# EAGLE design distance_sensor (EAGLE 5.06)
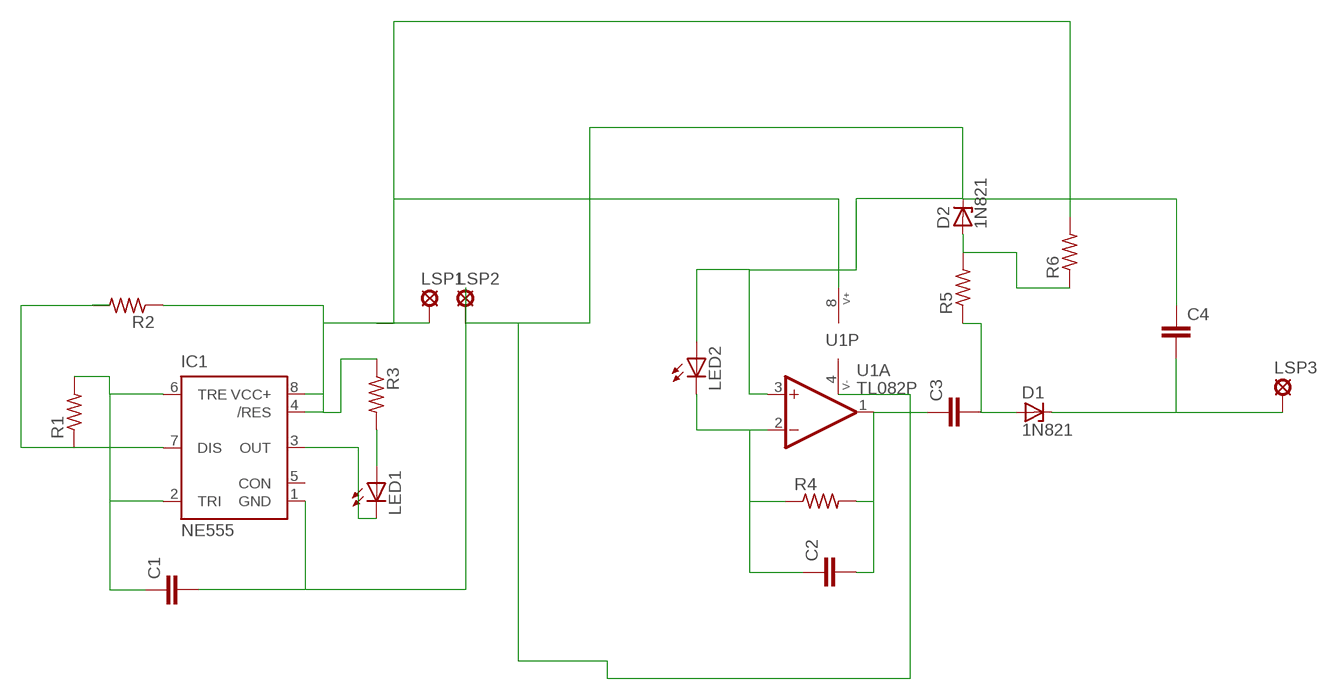
[diagram p0: schematic, sheet 1]

## Parts
C1  C5/4.5  [C5B4.5]
C2  C5/4.5  [C5B4.5]
C3  C5/4.5  [C5B4.5]
C4  C5/4.5  [C5B4.5]
D1  1N821  [DO35Z10]
D2  1N821  [DO35Z10]
IC1  NE555  [DIL-08]
LED1  LEDSFH480  [SFH480]
LED2  LEDSFH480  [SFH480]
LSP1  LSP10  [LSP10]
LSP2  LSP10  [LSP10]
LSP3  LSP10  [LSP10]
R1  R-US_0207/10  [0207/10]
R2  R-US_0207/10  [0207/10]
R3  R-US_0207/10  [0207/10]
R4  R-US_0207/10  [0207/10]
R5  R-US_0207/10  [0207/10]
R6  R-US_0207/10  [0207/10]
U1  TL082P  [DIL08]

## Nets
N$1: C3.2 D1.A R5.1
N$2: C1.1 IC1.2(TRI) IC1.6(TRE) R1.2
N$3: C1.2 C4.1 D2.C IC1.1(GND) LED2.A LSP2.MP U1.3(A:+IN) U1.4(P:V-)
N$4: IC1.7(DIS) R1.1 R2.2
N$5: IC1.4(/RES) IC1.8(VCC+) LSP1.MP R2.1 R3.1 R6.2 U1.8(P:V+)
N$6: LED1.A R3.2
N$7: IC1.3(OUT) LED1.K(C)
N$10: C2.1 LED2.K(C) R4.1 U1.2(A:-IN)
N$11: C2.2 C3.1 R4.2 U1.1(A:OUT)
N$13: C4.2 D1.C LSP3.MP
N$14: D2.A R5.2 R6.1
Unconnected: IC1.5(CON) U1.5(B:+IN) U1.6(B:-IN) U1.7(B:OUT)

## Library data of the parts
C1-C4 = capacitor-wima:C: CAPACITOR naming: grid - package width
D1 D2 = diode:1N821: Reference DIODE temperature compensated, 6,2 V
IC1 = st-microelectronics:NE555: General purpose bipolar Timer
LED1 LED2 = led:LED: LED OSRAM: - CHIPLED LG R971, LG N971, LY N971, LG Q971, LY Q971, LO R971, LY R971 LH N974, LH R974 LS Q976, LO Q976, LY Q976 LO Q996 - Hyper CHIPLED LW Q18S LB Q993, LB Q99A, LB R99A - SideLED LS A670, LO A670, LY A670, LG A670, LP A670 LB A673, LV A673, LT A673, LW A673 LH A674 LY A675 LS A676, LA A676, LO A676, LY A676, LW A676 LS A679, LY A679, LG A679 - Hyper Micro SIDELED® LS Y876, LA Y876, LO Y876, LY Y876 LT Y87S - SmartLED LW L88C, LW L88S LB L89C, LB L89S, LG L890 LS L89K, LO L89K, LY L89K LS L896, LA L896, LO L896, LY L896 - TOPLED LS T670, LO T670, LY T670, LG T670, LP T670 LSG T670, LSP T670, LSY T670, LOP T670, LYG T670 LG T671, LOG T671, LSG T671 LB T673, LV T673, LT T673, LW T673 LH T674 LS T676, LA T676, LO T676, LY T676, LB T676, LH T676, LSB T676, LW T676 LB T67C, LV T67C, LT T67C, LS T67K, LO T67K, LY T67K, LW E67C LS E67B, LA E67B, LO E67B, LY E67B, LB E67C, LV E67C, LT E67C LW T67C LS T679, LY T679, LG T679 LS T770, LO T770, LY T770, LG T770, LP T770 LB T773, LV T773, LT T773, LW T773 LH T774 LS E675, LA E675, LY E675, LS T675 LS T776, LA T776, LO T776, LY T776, LB T776 LHGB T686 LT T68C, LB T68C - Hyper Mini TOPLED® LB M676 - Mini TOPLED Santana® LG M470 LS M47K, LO M47K, LY M47K Source: http://www.osram.convergy.de LUXEON: - LUMILED® LXK2-PW12-R00, LXK2-PW12-S00, LXK2-PW14-U00, LXK2-PW14-V00 LXK2-PM12-R00, LXK2-PM12-S00, LXK2-PM14-U00 LXK2-PE12-Q00, LXK2-PE12-R00, LXK2-PE12-S00, LXK2-PE14-T00, LXK2-PE14-U00 LXK2-PB12-K00, LXK2-PB12-L00, LXK2-PB12-M00, LXK2-PB14-N00, LXK2-PB14-P00, LXK2-PB14-Q00 LXK2-PR12-L00, LXK2-PR12-M00, LXK2-PR14-Q00, LXK2-PR14-R00 LXK2-PD12-Q00, LXK2-PD12-R00, LXK2-PD12-S00 LXK2-PH12-R00, LXK2-PH12-S00 LXK2-PL12-P00, LXK2-PL12-Q00, LXK2-PL12-R00 Source: www.luxeon.com KINGBRIGHT: KA-3528ASYC Source: www.kingbright.com
LSP1-LSP3 = solpad:LSP10: SOLDER PAD drill 1.0 mm, distributor Buerklin, 12H555
R1-R6 = rcl:R-US_: RESISTOR, American symbol
U1 = op-amp:TL082: JFET OP-AMP - Dual

## Board
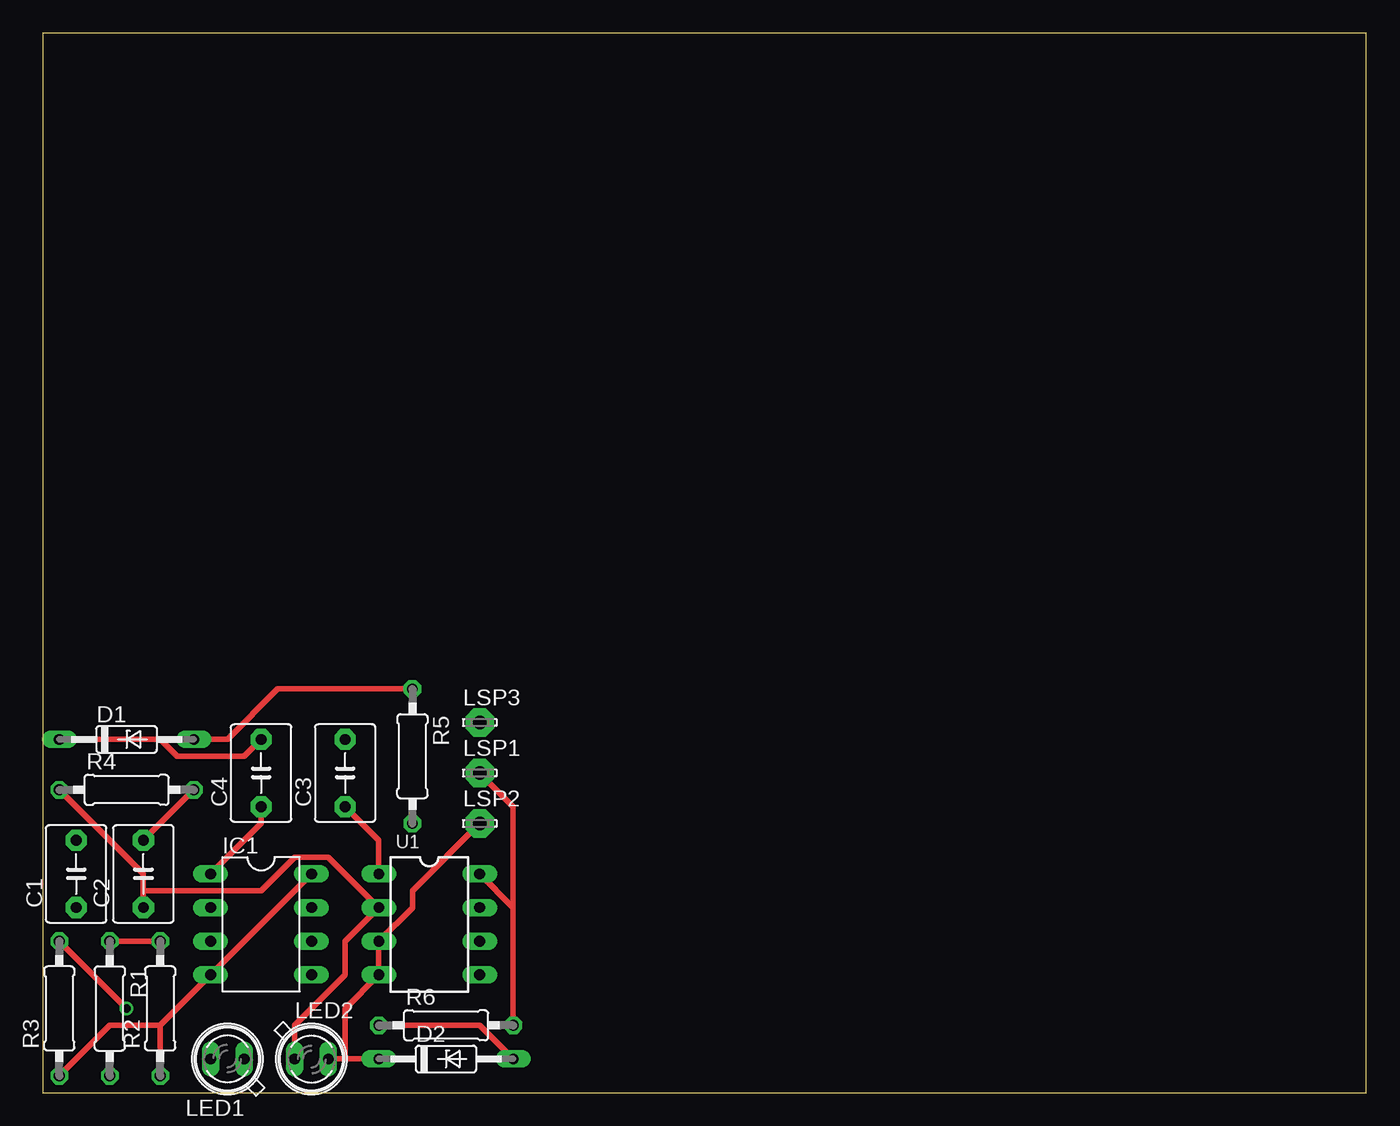
[diagram p1: board, top side]
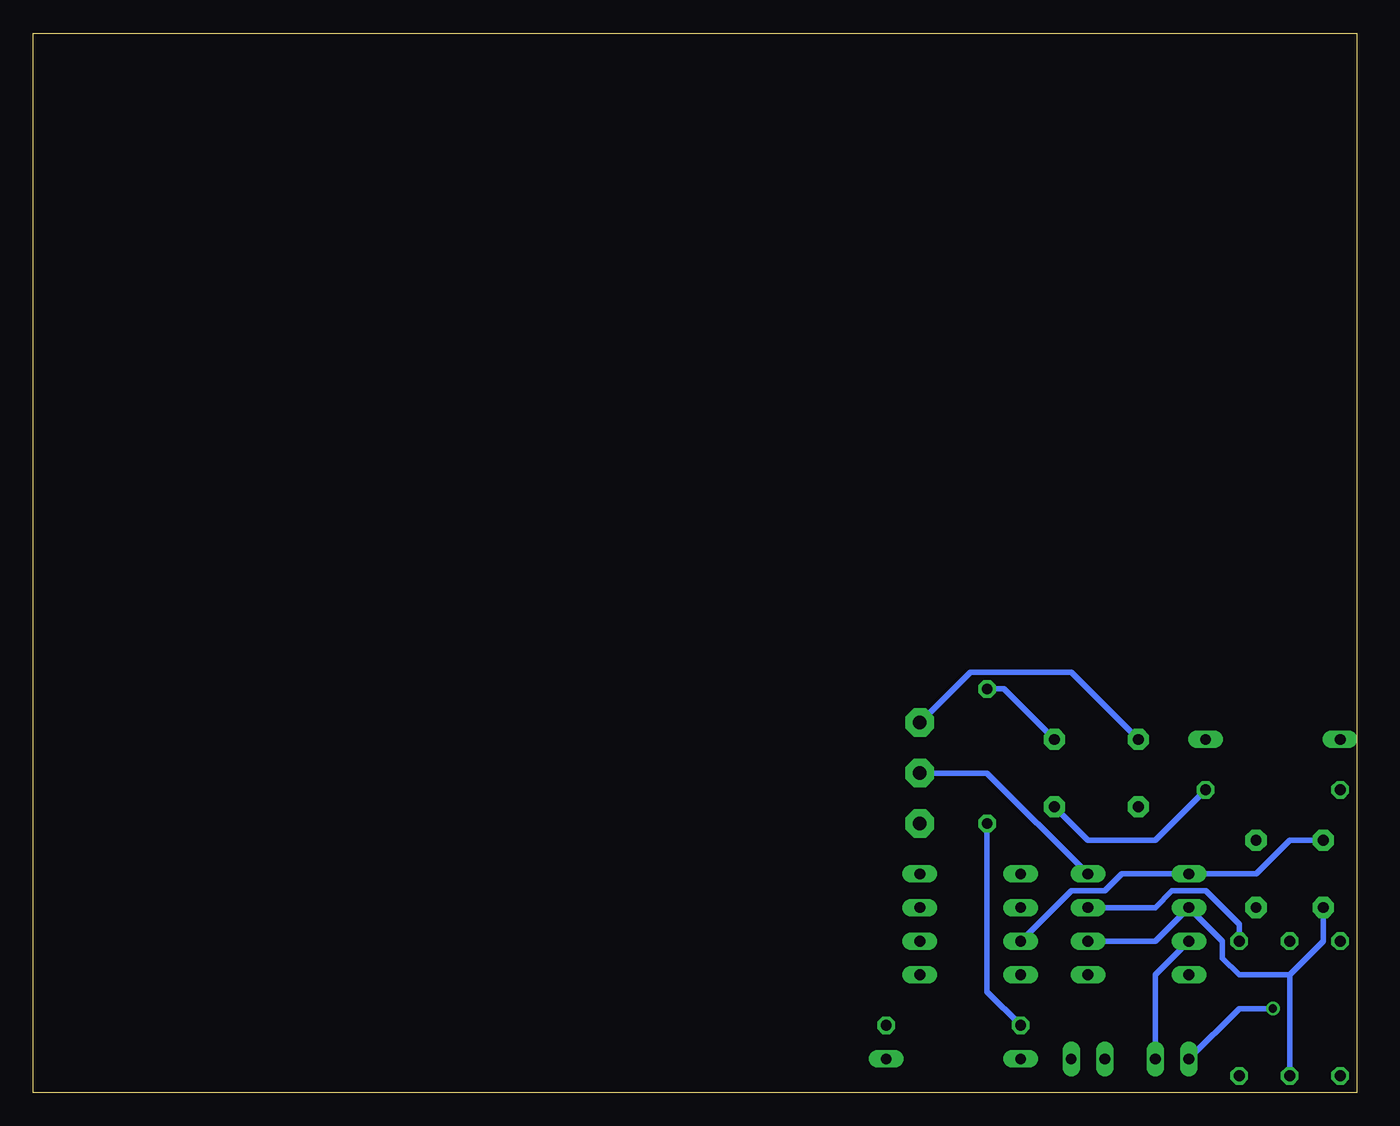
[diagram p2: board, bottom side, seen from below]

Size 100 x 80 mm. Coordinates in mm from the lower left corner, seen from the top.
Outline: 0,0 100,0 100,80 0,80 0,0
Copper layers (1*16): Top 0.035mm / dielectric 1.5mm / Bottom 0.035mm
Design rules "default *": minimum track width 16mil, minimum drill 24mil, track to track 12mil, track to pad 12mil, pad to pad 8mil, via to via 12mil, smd to smd 8mil, copper to edge 40mil, drill to drill 8mil, minimum pad ring 10mil, minimum via ring 8mil, stop-mask expansion 4mil, vias tented up to drill 0mil, thermal gap 10mil

### Footprints (pad centres in the part's own frame; a part is rotated, then mirrored left to right if it is on the bottom)
C5B4.5 = drill 0.813 pad 1.6 octagon: 1 -2.54,0; 2 2.54,0
DO35Z10 = drill 0.813 long: A 5.08,0; C -5.08,0
DIL-08 = drill 0.813 long: 1 -3.81,-3.81; 2 -1.27,-3.81; 3 1.27,-3.81; 4 3.81,-3.81; 5 3.81,3.81; 6 1.27,3.81; 7 -1.27,3.81; 8 -3.81,3.81
SFH480 = drill 0.813 long: A 1.27,0; K -1.27,0
LSP10 = drill 1.016 pad 2.159 octagon: MP 0,0
0207/10 = drill 0.813 octagon: 1 -5.08,0; 2 5.08,0
DIL08 = drill 0.813 long: 1 -3.81,-3.81; 2 -1.27,-3.81; 3 1.27,-3.81; 4 3.81,-3.81; 5 3.81,3.81; 6 1.27,3.81; 7 -1.27,3.81; 8 -3.81,3.81

### Placement (x,y rotation side)
C1  2.54,16.51 90 top
C2  7.62,16.51 90 top
C3  22.86,24.13 90 top
C4  16.51,24.13 90 top
D1  6.35,26.67 0 top
D2  30.48,2.54 0 top
IC1  16.51,12.7 270 top
LED1  13.97,2.54 180 top
LED2  20.32,2.54 0 top
LSP1  33.02,24.13 0 top
LSP2  33.02,20.32 0 top
LSP3  33.02,27.94 0 top
R1  5.08,6.35 270 top
R2  8.89,6.35 90 top
R3  1.27,6.35 90 top
R4  6.35,22.86 0 top
R5  27.94,25.4 270 top
R6  30.48,5.08 0 top
U1  29.21,12.7 270 top

### Tracks (layer width: path | path; a pad name or v marks a point on that pad's centre or on a via)
N$1
  Top 0.406: D1.A 13.97,26.67 17.78,30.48 R5.1
  Bottom 0.406: C3.2 26.67,30.48 R5.1
N$2
  Bottom 0.406: IC1.6 15.24,11.43 IC1.2 10.16,11.43 10.16,10.16 8.89,8.89 5.08,8.89 | R1.2 5.08,8.89 | 5.08,8.89 2.54,11.43 C1.1
N$3
  Top 0.406: IC1.1 16.51,20.32 C4.1 | 22.86,2.54 D2.C | 22.86,2.54 LED2.A | 22.86,2.54 22.86,6.35 U1.4 U1.3 27.94,13.97 27.94,15.24 LSP2.MP
  Bottom 0.406: C1.2 5.08,19.05 7.62,16.51 IC1.1 17.78,16.51 19.05,15.24 21.59,15.24 U1.3
N$4
  Top 0.406: R1.1 R2.2
  Bottom 0.406: IC1.7 15.24,13.97 13.97,15.24 11.43,15.24 8.89,12.7 R2.2
N$5
  Top 0.406: 35.56,13.97 R6.2 | 35.56,13.97 U1.8 | LSP1.MP 35.56,21.59 35.56,13.97 | R3.1 5.08,5.08 8.89,5.08 | 8.89,5.08 IC1.4 IC1.8 | 8.89,5.08 R2.1
  Bottom 0.406: LSP1.MP 27.94,24.13 IC1.8
N$6  (via drill 0.61)
  Top 0.406: R3.2 v6.35,6.35
  Bottom 0.406: v6.35,6.35 8.89,6.35 LED1.A
N$7
  Bottom 0.406: LED1.K 15.24,8.89 IC1.3
N$10
  Top 0.406: R4.1 7.62,16.51 7.62,15.24 | C2.1 7.62,15.24 | LED2.K 19.05,5.08 22.86,8.89 22.86,11.43 U1.2 21.59,17.78 19.05,17.78 16.51,15.24 7.62,15.24
N$11
  Top 0.406: C2.2 R4.2 | U1.1 25.4,19.05 C3.1
  Bottom 0.406: R4.2 15.24,19.05 20.32,19.05 C3.1
N$13
  Top 0.406: D1.C 8.89,26.67 10.16,25.4 15.24,25.4 C4.2
  Bottom 0.406: LSP3.MP 29.21,31.75 21.59,31.75 C4.2
N$14
  Top 0.406: R6.1 33.02,5.08 D2.A
  Bottom 0.406: R5.2 27.94,7.62 R6.1